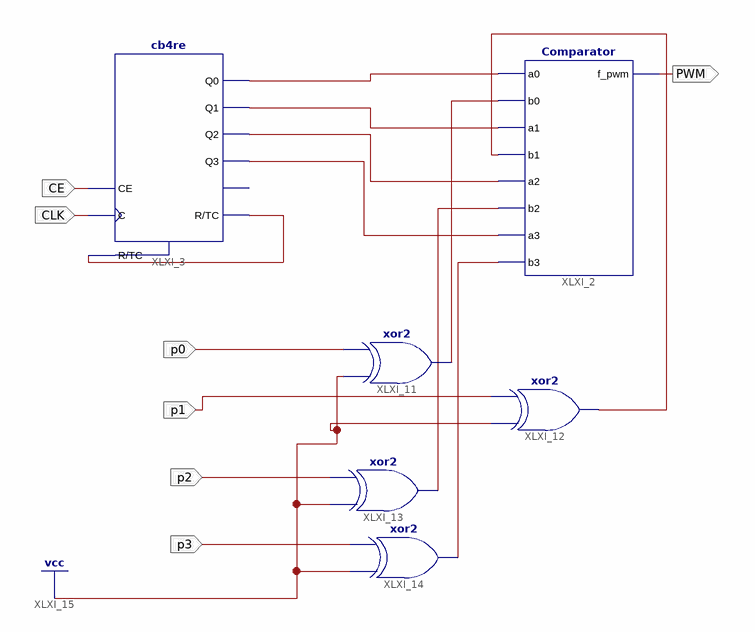
[diagram p0: schematic sheet 1]
// Xilinx ISE schematic PWM_VNB.sch (spartan3e) as structural Verilog: 6 symbols, 7 ports
module PWM_VNB (
  input  p0,
  input  p1,
  input  p2,
  input  p3,
  input  CLK,
  input  CE,
  output PWM
);

  wire Chk, q0, q1, q2, q3;

  Comparator XLXI_2 (.a0(q0), .b0(p0), .a1(q1), .b1(p1), .a2(q2), .b2(p2), .a3(q3), .b3(p3), .f_pwm(PWM));
  cb4re XLXI_3 (.C(CLK), .CE(CE), .R(Chk), .Q0(q0), .Q1(q1), .Q2(q2), .Q3(q3), .TC(Chk));  // open: CEO
  xor XLXI_11 (p0, 1'b1, p0);
  xor XLXI_12 (p1, 1'b1, p1);
  xor XLXI_13 (p2, 1'b1, p2);
  xor XLXI_14 (p3, 1'b1, p3);
endmodule
